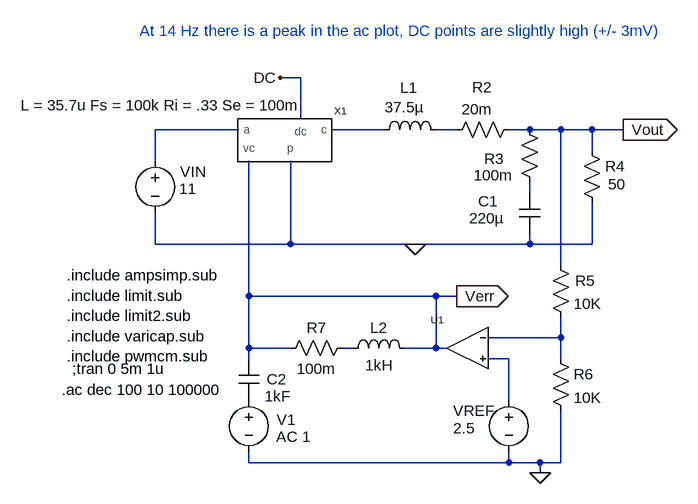
[diagram p0: schematic cm_dcm_chris.asc]
cm_dcm_chris.asc, the LTspice schematic file:
Version 4
SHEET 1 940 708
WIRE -1536 -1600 -1568 -1600
WIRE -1536 -1536 -1536 -1600
WIRE -1632 -1520 -1760 -1520
WIRE -1408 -1520 -1488 -1520
WIRE -1296 -1520 -1328 -1520
WIRE -1184 -1520 -1216 -1520
WIRE -1136 -1520 -1184 -1520
WIRE -1088 -1520 -1136 -1520
WIRE -1040 -1520 -1088 -1520
WIRE -1088 -1488 -1088 -1520
WIRE -1760 -1472 -1760 -1520
WIRE -1184 -1424 -1184 -1440
WIRE -1760 -1344 -1760 -1392
WIRE -1552 -1344 -1552 -1472
WIRE -1552 -1344 -1760 -1344
WIRE -1360 -1344 -1552 -1344
WIRE -1184 -1344 -1184 -1360
WIRE -1184 -1344 -1360 -1344
WIRE -1088 -1344 -1088 -1408
WIRE -1088 -1344 -1184 -1344
WIRE -1136 -1312 -1136 -1520
WIRE -1616 -1264 -1616 -1472
WIRE -1328 -1264 -1616 -1264
WIRE -1296 -1264 -1328 -1264
WIRE -1136 -1200 -1136 -1232
WIRE -1136 -1200 -1248 -1200
WIRE -1616 -1184 -1616 -1264
WIRE -1552 -1184 -1616 -1184
WIRE -1456 -1184 -1472 -1184
WIRE -1328 -1184 -1328 -1264
WIRE -1328 -1184 -1376 -1184
WIRE -1312 -1184 -1328 -1184
WIRE -1616 -1168 -1616 -1184
WIRE -1216 -1168 -1248 -1168
WIRE -1136 -1168 -1136 -1200
WIRE -1216 -1104 -1216 -1168
WIRE -1616 -1008 -1616 -1024
WIRE -1216 -1008 -1216 -1024
WIRE -1216 -1008 -1616 -1008
WIRE -1168 -1008 -1216 -1008
WIRE -1136 -1008 -1136 -1088
WIRE -1136 -1008 -1168 -1008
WIRE -1168 -992 -1168 -1008
FLAG -1568 -1600 DC
FLAG -1168 -992 0
FLAG -1360 -1344 0
FLAG -1296 -1264 Verr
IOPIN -1296 -1264 Out
FLAG -1040 -1520 Vout
IOPIN -1040 -1520 Out
SYMBOL Misc\\PWMCM -1584 -1488 R0
WINDOW 39 -383 -70 Left 0
SYMATTR InstName X1
SYMATTR Prefix X
SYMATTR Value PWMCM
SYMATTR SpiceLine L = 35.7u Fs = 100k Ri = .33 Se = 100m
SYMBOL voltage -1760 -1488 R0
WINDOW 0 38 33 Left 0
WINDOW 3 37 59 Left 0
WINDOW 123 0 0 Left 0
WINDOW 39 0 0 Left 0
SYMATTR InstName VIN
SYMATTR Value 11
SYMBOL voltage -1216 -1120 R0
WINDOW 0 -86 32 Left 0
WINDOW 3 -86 59 Left 0
WINDOW 123 0 0 Left 0
WINDOW 39 0 0 Left 0
SYMATTR InstName VREF
SYMATTR Value 2.5
SYMBOL ind -1424 -1504 R270
WINDOW 0 65 54 VTop 0
WINDOW 3 66 47 VBottom 0
SYMATTR InstName L1
SYMATTR Value 37.5µ
SYMBOL res -1312 -1504 R270
WINDOW 0 66 55 VTop 0
WINDOW 3 63 47 VBottom 0
SYMATTR InstName R2
SYMATTR Value 20m
SYMBOL res -1200 -1536 R0
WINDOW 0 -54 61 Left 0
WINDOW 3 -70 86 Left 0
SYMATTR InstName R3
SYMATTR Value 100m
SYMBOL cap -1200 -1424 R0
WINDOW 0 -63 14 Left 0
WINDOW 3 -77 40 Left 0
SYMATTR InstName C1
SYMATTR Value 220µ
SYMBOL res -1104 -1504 R0
WINDOW 3 41 68 Left 0
SYMATTR Value 50
SYMATTR InstName R4
SYMBOL res -1152 -1328 R0
WINDOW 0 38 40 Left 0
SYMATTR InstName R5
SYMATTR Value 10K
SYMBOL res -1152 -1184 R0
SYMATTR InstName R6
SYMATTR Value 10K
SYMBOL Misc\\ampsimp -1280 -1184 M0
SYMATTR InstName U1
SYMATTR SpiceModel ""
SYMATTR Value AMPSIMP
SYMBOL ind -1472 -1168 R270
WINDOW 0 32 56 VTop 0
WINDOW 3 5 56 VBottom 0
SYMATTR InstName L2
SYMATTR Value 1kH
SYMBOL res -1568 -1168 R270
WINDOW 0 32 56 VTop 0
WINDOW 3 0 56 VBottom 0
SYMATTR InstName R7
SYMATTR Value 100m
SYMBOL voltage -1616 -1120 R0
WINDOW 0 43 46 Left 0
WINDOW 3 39 73 Left 0
WINDOW 123 42 72 Left 0
WINDOW 39 0 0 Left 0
SYMATTR InstName V1
SYMATTR Value ""
SYMATTR Value2 AC 1
SYMBOL cap -1632 -1168 R0
WINDOW 0 43 32 Left 0
WINDOW 3 40 58 Left 0
SYMATTR InstName C2
SYMATTR Value 1kF
TEXT -1896 -1296 Left 0 !.include ampsimp.sub\n.include limit.sub\n.include limit2.sub\n.include varicap.sub\n.include pwmcm.sub
TEXT -1904 -1120 Left 0 !.ac dec 100 10 100000
TEXT -1888 -1152 Left 0 !;tran 0 5m 1u
TEXT -1784 -1672 Left 0 ;At 14 Hz there is a peak in the ac plot, DC points are slightly high (+/- 3mV)

The netlist it stands for:
* cm_dcm_chris.asc
XX1 N001 N002 0 Verr DC PWMCM L = 35.7u Fs = 100k Ri = .33 Se = 100m  ; pins a c p vc dc
VIN N001 0 11
VREF N007 0 2.5
L1 N002 N003 37.5µ
R2 N003 Vout 20m
R3 Vout N004 100m
C1 N004 0 220µ
R4 Vout 0 50
R5 Vout N005 10K
R6 N005 0 10K
XU1 N007 N005 Verr AMPSIMP  ; pins In+ In- OUT
L2 N006 Verr 1kH
R7 Verr N006 100m
V1 P001 0 AC 1
C2 Verr P001 1kF
.include ampsimp.sub
.include limit.sub
.include limit2.sub
.include varicap.sub
.include pwmcm.sub
.ac dec 100 10 100000
;tran 0 5m 1u
* At 14 Hz there is a peak in the ac plot, DC points are slightly high (+/- 3mV)
.backanno
.end